# Altium project DC-DC_Bridge.PrjPcb
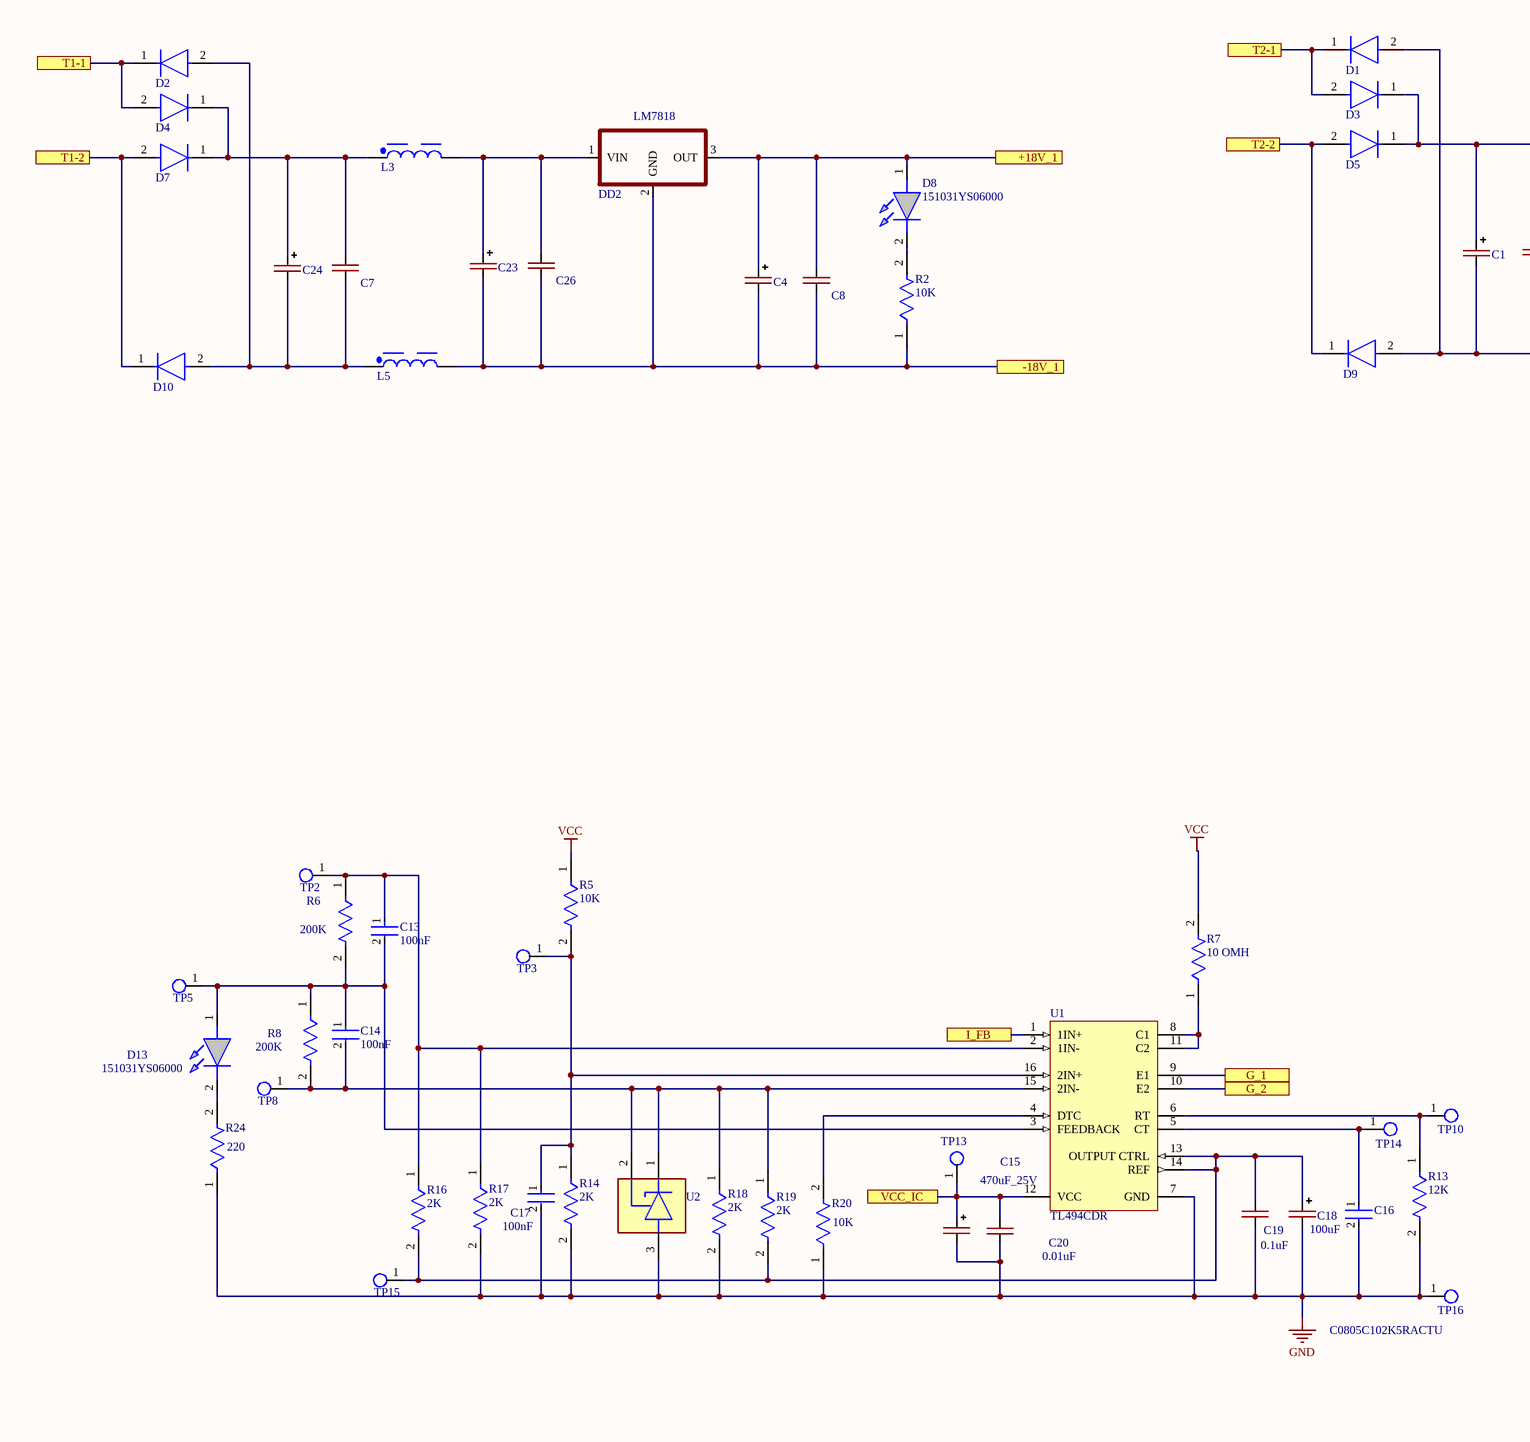
[diagram p0: DC-DC_Bridge.SchDoc, left]
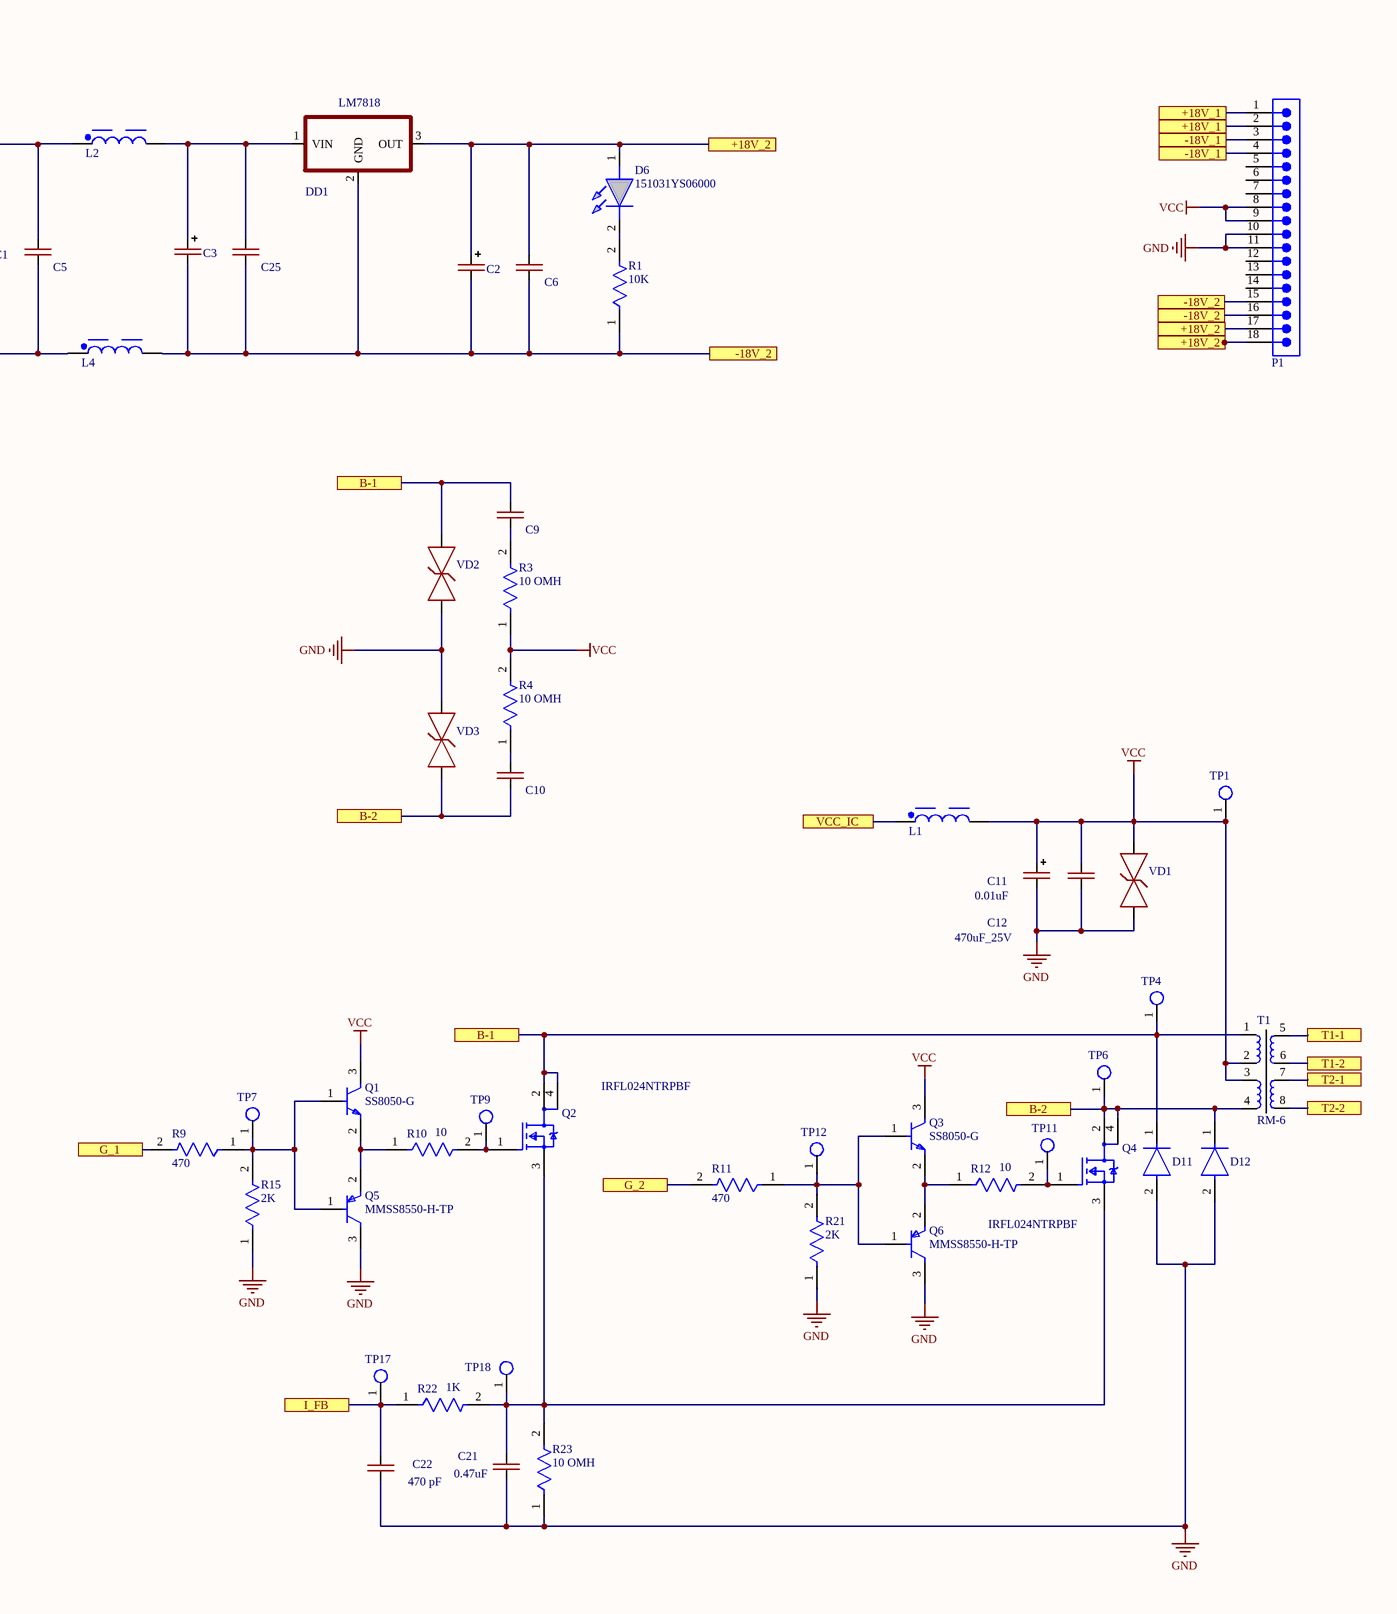
[diagram p1: DC-DC_Bridge.SchDoc, right]
1 sheet, 101 parts. Net scope: flat (ports and power ports of the same name join across sheets).
Board file: DC-DC_Bridge.PcbDoc

## Sheet DC-DC_Bridge.SchDoc
size A2; SheetNumber: 1; SheetTotal: 1; SPICEModelCacheUJGLTUQW: <root> / <DocumentId>UJGLTUQW</DocumentId> / <CacheFrame Number="0"> / <Model Name="7850_744775239_390u" Kind="CKT"> / <Text>******* / .subckt 7850_744775239_390u 1 2 / Rp 1 2 180000 / Cp 1 2 5p / Rs 1 N3 1.151 / L1 N3 2 390u / .ends 7850_744775239_390u</Text> / </Model> / </CacheFrame> / </root>

### Parts
C1  CAP-POLAR  [CAP_SMD_Size_G]  (value not drawn)
C2  CAP-POLAR  [CAP_SMD_Size_G]  (value not drawn)
C3  CAP-POLAR  [CAP_SMD_Size_G]  (value not drawn)
C4  CAP-POLAR  [CAP_SMD_Size_G]  (value not drawn)
C5  CAP-NON-POLAR  [CAP-0805]  (value not drawn)
C6  CAP-NON-POLAR  [CAP-0805]  (value not drawn)
C7  CAP-NON-POLAR  [CAP-0805]  (value not drawn)
C8  CAP-NON-POLAR  [CAP-0805]  (value not drawn)
C9  CAP-V  [CAP-V]  (value not drawn)
C10  CAP-V  [CAP-V]  (value not drawn)
C11  0.01uF  [CAP-0805]
C12  470uF_25V  [CAPPOL-16x25]
C13  100nF  [FP-C0805C-DN-MFG]
C14  100nF  [FP-C0805C-DN-MFG]
C15  470uF_25V  [CAP_SMD_Size_G]
C16  C0805C102K5RACTU  [FP-C0805C-DN-MFG]
C17  100nF  [FP-C0805C-DN-MFG]
C18  100uF  [CAP-TAN-D]
C19  0.1uF  [CAP-0805]
C20  0.01uF  [CAP-0805]
C21  0.47uF  [CAP-0805]
C22  470 pF  [CAP-0805]
C23  CAP-POLAR  [CAP_SMD_Size_G]  (value not drawn)
C24  CAP-POLAR  [CAP_SMD_Size_G]  (value not drawn)
C25  CAP-NON-POLAR  [CAP-0805]  (value not drawn)
C26  CAP-NON-POLAR  [CAP-0805]  (value not drawn)
D1  US1G  [DO-214AA]  (value not drawn)
D2  US1G  [DO-214AA]  (value not drawn)
D3  US1G  [DO-214AA]  (value not drawn)
D4  US1G  [DO-214AA]  (value not drawn)
D5  US1G  [DO-214AA]  (value not drawn)
D6  151031YS06000  [LED_RED]
D7  US1G  [DO-214AA]  (value not drawn)
D8  151031YS06000  [LED_RED]
D9  US1G  [DO-214AA]  (value not drawn)
D10  US1G  [DO-214AA]  (value not drawn)
D11  US1G  [DO-214AA]  (value not drawn)
D12  US1G  [DO-214AA]  (value not drawn)
D13  151031YS06000  [LED_RED]
DD1  LM7818  [TO-252]  (value not drawn)
DD2  LM7818  [TO-252]  (value not drawn)
L1  390µH, 0.38A  [WE-PD2_7850]  (value not drawn)
L2  390µH, 0.38A  [WE-PD2_7850]  (value not drawn)
L3  390µH, 0.38A  [WE-PD2_7850]  (value not drawn)
L4  390µH, 0.38A  [WE-PD2_7850]  (value not drawn)
L5  390µH, 0.38A  [WE-PD2_7850]  (value not drawn)
P1  61301811021  [61301811021]  (value not drawn)
Q1  SS8050-G  [FP-SS8050-G-MFG]
Q2  IRFL024NTRPBF  [FP-PG-SOT223-3-IPC_B]
Q3  SS8050-G  [FP-SS8050-G-MFG]
Q4  IRFL024NTRPBF  [FP-PG-SOT223-3-IPC_B]
Q5  MMSS8550-H-TP  [FP-SOT-23-IPC_B]
Q6  MMSS8550-H-TP  [FP-SOT-23-IPC_B]
R1  10K  [RES-0805]
R2  10K  [RES-0805]
R3  10 OMH  [RES-1206]
R4  10 OMH  [RES-1206]
R5  10K  [FP-CRCW0805-e3-MFG]
R6  200K  [FP-CRCW0805-e3-MFG]
R7  10 OMH  [RES-1206]
R8  200K  [FP-CRCW0805-e3-MFG]
R9  470  [RES-0805]
R10  10  [RES-0805]
R11  470  [RES-0805]
R12  10  [RES-0805]
R13  12K  [FP-CRCW0805-e3-MFG]
R14  2K  [FP-CRCW0805-e3-MFG]
R15  2K  [RES-0805]
R16  2K  [FP-CRCW0805-e3-MFG]
R17  2K  [FP-CRCW0805-e3-MFG]
R18  2K  [FP-CRCW0805-e3-MFG]
R19  2K  [FP-CRCW0805-e3-MFG]
R20  10K  [RES-0805]
R21  2K  [RES-0805]
R22  1K  [RES-0805]
R23  10 OMH  [RES-2512]
R24  220  [RES-0805]
T1  RM-6  [TRANS_RM6]
TP1  (no value)  [Test_Point]
TP2  Test_Point_PCB  [Test_Point]  (value not drawn)
TP3  Test_Point_PCB  [Test_Point]  (value not drawn)
TP4  (no value)  [Test_Point]
TP5  Test_Point_PCB  [Test_Point]  (value not drawn)
TP6  (no value)  [Test_Point]
TP7  (no value)  [Test_Point]
TP8  (no value)  [Test_Point]
TP9  (no value)  [Test_Point]
TP10  (no value)  [Test_Point]
TP11  (no value)  [Test_Point]
TP12  (no value)  [Test_Point]
TP13  (no value)  [Test_Point]
TP14  Test_Point_PCB  [Test_Point]  (value not drawn)
TP15  Test_Point_PCB  [Test_Point]  (value not drawn)
TP16  (no value)  [Test_Point]
TP17  (no value)  [Test_Point]
TP18  (no value)  [Test_Point]
U1  TL494CDR  [D0016A_N]
U2  TL431  [TL431_SOT-23-3(A)]  (value not drawn)
VD1  Suppressor  [DO-214AA]  (value not drawn)
VD2  Suppressor  [P6KE350CA]  (value not drawn)
VD3  Suppressor  [P6KE350CA]  (value not drawn)

### Ports
+18V_1, +18V_2, -18V_1, -18V_2, B-1, B-2, G_1, G_2, I_FB, T1-1, T1-2, T2-1, T2-2, VCC_IC

### Nets
GND: C11.1 C12.2(-) C15.2(-) C16.2 C17.2 C18.2(-) C19.1 C20.1 C21.1 C22.1 D11.2(A) D12.2(A) P1.10 P1.11 Q5.3(C) Q6.3(C) R13.2 R14.2 R15.1 R17.2 R18.2 R20.1 R21.1 R23.1 R24.1 TP16.1(G9) U1.7(GND) U2.3(A) VD1.1(C) VD2.1(C) VD3.2(A)
VCC: C11.2 C12.1(+) L1.2 P1.8 P1.9 Q1.3(C) Q3.3(C) R3.1 R4.2 R5.1 R7.2 T1.2 T1.3 TP1.1(G9) VD1.2(A)
NetC1_1: C1.1(+) C5.2 D3.1(C) D5.1(C) L2.1
NetC1_2: C1.2(-) C5.1 D1.2(A) D9.2(A) L4.1
NetC2_1: C2.1(+) C6.2 D6.1(A) DD1.3(OUT) P1.17 P1.18 ; port +18V_2
NetC2_2: C2.2(-) C3.2(-) C6.1 C25.1 DD1.2(GND) L4.2 P1.15 P1.16 R1.1 ; port -18V_2
NetC3_1: C3.1(+) C25.2 DD1.1(VIN) L2.2
NetC4_1: C4.1(+) C8.2 D8.1(A) DD2.3(OUT) P1.1 P1.2 ; port +18V_1
NetC4_2: C4.2(-) C8.1 C23.2(-) C26.1 DD2.2(GND) L5.2 P1.3 P1.4 R2.1 ; port -18V_1
NetC7_1: C7.1 C24.2(-) D2.2(A) D10.2(A) L5.1
NetC7_2: C7.2 C24.1(+) D4.1(C) D7.1(C) L3.1
NetC9_1: C9.1 R3.2
NetC9_2: C9.2 D11.1(C) Q2.2(D) Q2.4(D) T1.1 TP4.1(G9) VD2.2(A) ; port B-1
NetC10_1: C10.1 D12.1(C) Q4.2(D) Q4.4(D) T1.4 TP6.1(G9) VD3.1(C) ; port B-2
NetC10_2: C10.2 R4.1
NetC13_1: C13.1 R6.1 R16.1 R17.1 TP2.1(G9) U1.2(1IN-)
NetC13_2: C13.2 C14.1 D13.1(A) R6.2 R8.1 TP5.1(G9) U1.3(FEEDBACK)
NetC14_2: C14.2 R8.2 R18.1 R19.1 TP8.1(G9) U1.15(2IN-) U2.1(C) U2.2(REF)
NetC15_1: C15.1(+) C20.2 L1.1 TP13.1(G9) U1.12(VCC) ; port VCC_IC
NetC16_1: C16.1 TP14.1(G9) U1.5(CT)
NetC17_1: C17.1 R5.2 R14.1 TP3.1(G9) U1.16(2IN+)
NetC18_1: C18.1(+) C19.2 R16.2 R19.2 TP15.1(G9) U1.13(OUTPUT_CTRL) U1.14(REF)
NetC21_2: C21.2 Q2.3(S) Q4.3(S) R22.2 R23.2 TP18.1(G9)
NetC22_2: C22.2 R22.1 TP17.1(G9) U1.1(1IN+) ; port I_FB
NetC23_1: C23.1(+) C26.2 DD2.1(VIN) L3.2
NetD1_1: D1.1(C) D3.2(A) T1.7 ; port T2-1
NetD2_1: D2.1(C) D4.2(A) T1.5 ; port T1-1
NetD5_2: D5.2(A) D9.1(C) T1.8 ; port T2-2
NetD6_2: D6.2(K) R1.2
NetD7_2: D7.2(A) D10.1(C) T1.6 ; port T1-2
NetD8_2: D8.2(K) R2.2
NetD13_2: D13.2(K) R24.2
NetQ1_1: Q1.1(B) Q5.1(B) R9.1 R15.2 TP7.1(G9)
NetQ1_2: Q1.2(E) Q5.2(E) R10.1
NetQ2_1: Q2.1(G) R10.2 TP9.1(G9)
NetQ3_1: Q3.1(B) Q6.1(B) R11.1 R21.2 TP12.1(G9)
NetQ3_2: Q3.2(E) Q6.2(E) R12.1
NetQ4_1: Q4.1(G) R12.2 TP11.1(G9)
NetR7_1: R7.1 U1.8(C1) U1.11(C2)
NetR9_2: R9.2 U1.9(E1) ; port G_1
NetR11_2: R11.2 U1.10(E2) ; port G_2
NetR13_1: R13.1 TP10.1(G9) U1.6(RT)
NetR20_2: R20.2 U1.4(DTC)

Not connected (* = marked no-connect by the designer): P1 5 6 7 12 13 14

### Library data of the parts
C11 C19-C22 = CAP-NON-POLAR
C12 C15 C18 = CAP-POLAR
C13 C14 C17 = CMP-2007-00254-2: CAP CER 10000PF 50V X7R 0805; Manufacturer Part Number: C0805C103J5RACTU; Manufacturer: KEMET; Value: 10,000 pF; Material: Ceramic; Temperature Coefficient: 30ppm/°C; Tolerance: 0.05; Device Class L1: Passive Components; Temperature: -55°C to +125°C; Lead Free: Yes; ComponentLink2URL: https://content.kemet.com/datasheets/KEM_C1003_C0G_SMD.pdf; Device Class L3: Ceramic Capacitors; Temperature Characteristic: X7R; Temperature Range High: +125°C; Mouser Description: Capacitor; Ceramic; Cap 0.01uF; Tol 5%; Vol-Rtg 50 V; SMT; Case 0805; X7R; TR; ComponentLink2Description: Datasheet; Height: 0.88mm; Digikey Description: CAP CER 10000PF 50V X7R 0805; Capacitance: 10,000 pF; Temperature Range Low: -55°C; Device Class L2: Capacitors; Octopart: https://octopart.com/c0805c103j5ractu-kemet-133473; Voltage Rating: 50 V; Category: Cap; RoHS: TRUE; Automotive: No; Package: C0805C-DN; Ipc Land Pattern Name: CAPC200125X78
C16 = CMP-2007-01097-2: CAP CER 1000PF 50V X7R 0805; Manufacturer: KEMET; Capacitance: 1,000 pF; Value: 1,000 pF; Tolerance: 0.1; Temperature Coefficient: 30ppm/°C; Material: Ceramic; Temperature Range High: +125°C; Automotive: No; Device Class L3: Ceramic Capacitors; Category: Cap; Height: 0.88mm; Ipc Land Pattern Name: CAPC200125X78; Mouser Description: Cap Ceramic 0.001uF 50V X7R 10% SMD 0805 125C Plastic T/R; Device Class L1: Passive Components; Lead Free: Yes; Temperature Range Low: -55°C; ComponentLink2URL: https://content.kemet.com/datasheets/KEM_C1003_C0G_SMD.pdf; Octopart: https://octopart.com/c0805c102k5ractu-kemet-93010; Temperature: -55°C to +125°C; Package: C0805C-DN; RoHS: TRUE; Voltage Rating: 50 V; ComponentLink2Description: Datasheet; Digikey Description: CAP CER 1000PF 50V X7R 0805; Device Class L2: Capacitors; Manufacturer Part Number: C0805C102K5RACTU; Temperature Characteristic: X7R
D6 D8 D13 = LED: WURTH ELEKTRONIK - 151031YS06000 - LED, Yellow, Through Hole, T-1 (3mm), 30 mA, 2 V, 590 nm; Geometry.Height: 5.5mm; Manufacturer_Name: Wurth Elektronik; Manufacturer_Part_Number: 151031YS06000; Mouser Part Number: 710-151031YS06000; Mouser Price/Stock: https://www.mouser.co.uk/ProductDetail/Wurth-Elektronik/151031YS06000?qs=LlUlMxKIyB3xSYYW%252BcuBiQ%3D%3D; Arrow Part Number: *; Arrow Price/Stock: *; Mouser Testing Part Number: *; Mouser Testing Price/Stock: *; Datasheet Link: https://katalog.we-online.de/led/datasheet/151031YS06000.pdf
L1-L5 = 744775239: WE-PD2 SMT Power Inductor, size 7850, 390µH, 0.38A, 1.77Ω; Manufacturer: Wurth Elektronik; Case/Size Code: 7850; DC Resistance: 1.151Ω; Saturation Current: 0.43A; Self Resonant Frequency: 3.9MHz; Manufacturer Part Number: 744775239; Category: Unshielded Power Inductors; Match Code: WE-PD2; ComponentLink1Description: Website Link; ComponentLink1URL: https://www.we-online.com/redexpert/article/744775239?ad; ComponentLink2Description: Datasheet Link; ComponentLink2URL: https://www.we-online.com/redexpert/spec/744775239?ad; Mount: Surface Mount; Operating Temperature Max: 125°C; Operating Temperature Min: -40°C; Packaging: Tape and Reel; Length: 7.8mm; Width: 7mm; Height: 4.95mm; DC Resistance Max: 1.77Ω; Inductance: 390µH; Rated Current: 0.38A
P1 = 61301811021: WR-PHD Pin Header, THT, Angled, pitch 2.54mm, 1 Row, 18P; Manufacturer: Wurth Elektronik; Contact Resistance: 20mΩ; Rated Current: 3A; Working Voltage: 250V; Withstanding Voltage: 500V; ComponentLink1Description: Website Link; ComponentLink1URL: https://www.we-online.com/redexpert/article/61301811021?ad; ComponentLink2Description: Datasheet Link; ComponentLink2URL: https://www.we-online.com/redexpert/spec/61301811021?ad; Manufacturer Part Number: 61301811021; Category: Board-to-Board Connectors; Match Code: WR-PHD; Mount: Through Hole; Operating Temperature Max: 105°C; Operating Temperature Min: -40°C; Packaging: Bag; Gender: Pin Header; Number of Pins: 18; Number of Rows: 1; Orientation: Angled; Pitch: 2.54mm
Q1 Q3 = CMP-20235-000001-1: NPN TRANSISTOR 1.5A 40V SOT-23 R; Transition Frequency: 100MHz; Max Breakdown Voltage: 25V; Collector Emitter Voltage (VCEO): 400mV; Max Power Dissipation: 300mW; Max Collector Current: 1.5A; Case/Package: TO-236-3; Packaging: Tape and Reel; RoHS Compliant: Yes; Mount: Surface Mount; Collector Emitter Breakdown Voltage: 25V
Q2 Q4 = CMP-32901-001217-1: MOSFET N-CH 55V 2.8A SOT223; Max Power Dissipation: 1W; Turn-On Delay Time: 8.1ns; Drain to Source Resistance: 75mR; Gate to Source Voltage (Vgs): 20V; Polarization: N; Turn-Off Delay Time: 22.2ns; Threshold Voltage: 4V; Power Dissipation: 2.1W; Input Capacitance: 400pF; Number of Pins: 3; Max Operating Temperature: 150°C; Drain to Source Voltage (Vdss): 55V; RoHS Compliant: Yes; Case/Package: SOT-223; Series: HEXFET®; Lead Free: Contains Lead; Max Dual Supply Voltage: 55V; Packaging: Cut Tape; Drain to Source Breakdown Voltage: 55V; Reach SVHC Compliant: Yes; Mount: Surface Mount; Height: 0.057inch; Width: 0.146inch; Min Operating Temperature: -55°C; Rds On Max: 75mR; Halogen Free: Halogen Free; Continuous Drain Current (ID): 2.8A; Length: 0.263inch
Q5 Q6 = CMP-56214-000002-1: TRANS PNP 25V 1.5A SOT23; Emitter Base Voltage (VEBO): 1.6V; Collector Base Voltage (VCBO): 40V; Collector Emitter Saturation Voltage: 500mV; Max Power Dissipation: 625mW; Transition Frequency: 100MHz; Element Configuration: Single; hFE Min: 40; Polarity: PNP; Lead Free: Lead Free; Max Breakdown Voltage: 25V; Package Quantity: 1; Min Operating Temperature: -55°C; Case/Package: SOT-23; Max Collector Current: 1.5A; Mount: Surface Mount; Packaging: Tape and Reel; Collector Emitter Voltage (VCEO): 500mV; Max Operating Temperature: 150°C; Gain Bandwidth Product: 100MHz; Collector Emitter Breakdown Voltage: 25V
R1-R4 R7 R9-R12 R15 R20-R24 = RES-CONST
R5 R6 R8 R14 R16 R18 R19 = CMP-2001-04908-2: RES Thick Film, 2kΩ, 1%, 0.125W, 100ppm/°C, 0805; Resistance: 10kR; Voltage Rating (DC): 150V; Power Rating: 125mW; Weight: 0.000194oz; Package Quantity: 5000; Military Standard: Not; Max Operating Temperature: 155°C; Temperature Coefficient: 100ppm/°C; Contact Plating: Tin; Width: 1.25mm; Height: 0.45mm; Radiation Hardening: No; Tolerance: 1%; Min Operating Temperature: -55°C; Voltage Rating: 150V; Length: 2mm; Depth: 1.25mm; Termination: SMD/SMT; Packaging: Tape and Reel; Case/Package: 0805; Case Code (Metric): 2012; Lead Free: Lead Free; Case Code (Imperial): 0805; Composition: Thick Film
R13 = CMP-2001-04908-2: RES Thick Film, 12kΩ, 1%, 0.125W, 100ppm/°C, 0805; Resistance: 10kR; Voltage Rating (DC): 150V; Power Rating: 125mW; Weight: 0.000194oz; Package Quantity: 5000; Military Standard: Not; Max Operating Temperature: 155°C; Temperature Coefficient: 100ppm/°C; Contact Plating: Tin; Width: 1.25mm; Height: 0.45mm; Radiation Hardening: No; Tolerance: 1%; Min Operating Temperature: -55°C; Voltage Rating: 150V; Length: 2mm; Depth: 1.25mm; Termination: SMD/SMT; Packaging: Tape and Reel; Case/Package: 0805; Case Code (Metric): 2012; Lead Free: Lead Free; Case Code (Imperial): 0805; Composition: Thick Film
R17 = CMP-2001-04908-2: RES Thick Film, 82kΩ, 1%, 0.125W, 100ppm/°C, 0805; Resistance: 10kR; Voltage Rating (DC): 150V; Power Rating: 125mW; Weight: 0.000194oz; Package Quantity: 5000; Military Standard: Not; Max Operating Temperature: 155°C; Temperature Coefficient: 100ppm/°C; Contact Plating: Tin; Width: 1.25mm; Height: 0.45mm; Radiation Hardening: No; Tolerance: 1%; Min Operating Temperature: -55°C; Voltage Rating: 150V; Length: 2mm; Depth: 1.25mm; Termination: SMD/SMT; Packaging: Tape and Reel; Case/Package: 0805; Case Code (Metric): 2012; Lead Free: Lead Free; Case Code (Imperial): 0805; Composition: Thick Film
T1 = RM_6_12-12-18-18
TP1-TP18 = TP_PCB?: Test_Point
U1 = CMP-0319-00950-2: Pulse-Width-Modulation Control Circuit with Voltage Control, 45 % Duty Cycle, 0 to +70 degC, 16-pin SOIC (D), Green (RoHS & no Sb/Br); Manufacturer: Texas Instruments; Regulated Outputs(#): 2; Frequency(Max)(kHz): 300; Topology: Boost, Buck, Flyback, Forward, Full-Bridge, Half-Bridge, Push-Pull; SubFamily: PWM Controller; Duty Cycle(Max)(%): 45; Rating: Military; PackageDescription: 16-Pin Plastic Small Outline Integrated Circuit, 9.9 x 3.9 mm, Pitch 1.27 mm Pitch; Mounting Technology: Surface Mount; PackageReference: D0016A; DatasheetVersion: SLVS074E; Control Method: Voltage; ComponentLink1Description: Datasheet; ComponentLink1URL: http://www.ti.com/general/docs/lit/getliterature.tsp?genericPartNumber=TL494&fileType=pdf; Code_JEDEC: MS-012AC; Eco-Plan: Green (RoHS & no Sb/Br); PackageVersion: revM, Jun-2011; PartNumber: TL494CDR
U2 = TL431_SOT-23-3